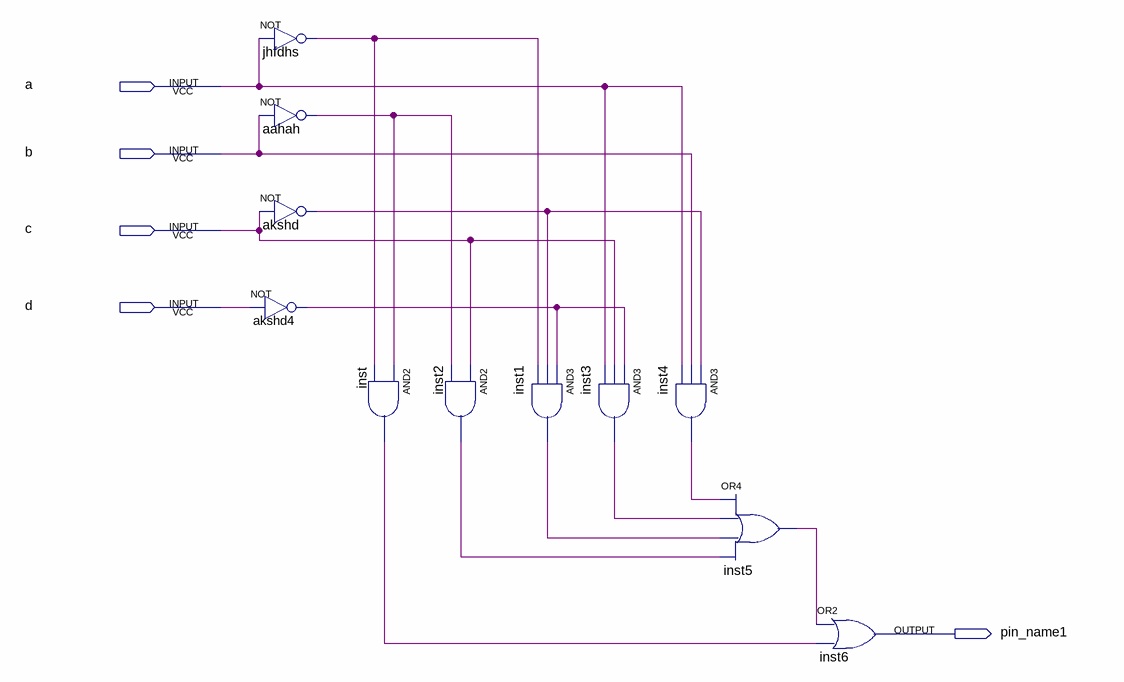
[diagram p0: schematic sheet]
// Quartus schematic decod1-5.bdf as structural Verilog: 11 symbols, 5 pins
module \decod1-5  (
  input  a,
  input  b,
  input  c,
  input  d,
  output pin_name1
);

  wire aahah_out, akshd4_out, akshd_out, inst1_out, inst2_out, inst3_out, inst4_out, inst5_out, inst_out,
       jhfdhs_out;

  not jhfdhs (jhfdhs_out, a);
  not aahah (aahah_out, b);
  not akshd (akshd_out, c);
  not akshd4 (akshd4_out, d);
  and inst (inst_out, aahah_out, jhfdhs_out);
  and inst2 (inst2_out, c, aahah_out);
  and inst1 (inst1_out, akshd4_out, akshd_out, jhfdhs_out);
  and inst3 (inst3_out, akshd4_out, c, a);
  and inst4 (inst4_out, akshd_out, b, a);
  or inst5 (inst5_out, inst4_out, inst3_out, inst1_out, inst2_out);
  or inst6 (pin_name1, inst5_out, inst_out);
endmodule
